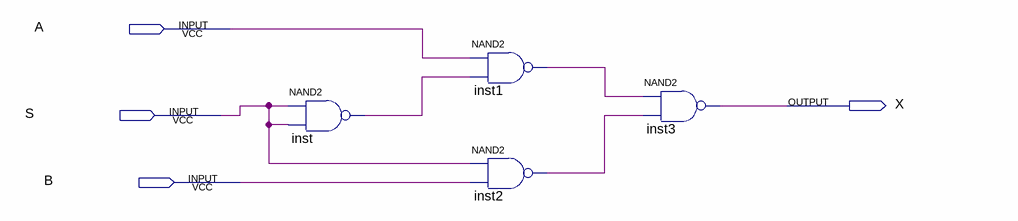
[diagram p0: schematic sheet]
// Quartus schematic multiplexador_2_entradas.bdf as structural Verilog: 4 symbols, 4 pins
module multiplexador_2_entradas (
  input  A,
  input  S,
  input  B,
  output X
);

  wire inst1_out, inst2_out, inst_out;

  nand inst (inst_out, S, S);
  nand inst1 (inst1_out, A, inst_out);
  nand inst2 (inst2_out, S, B);
  nand inst3 (X, inst1_out, inst2_out);
endmodule
